# Altium schematic sheet Part23_ETH_LAN.SchDoc
size A4
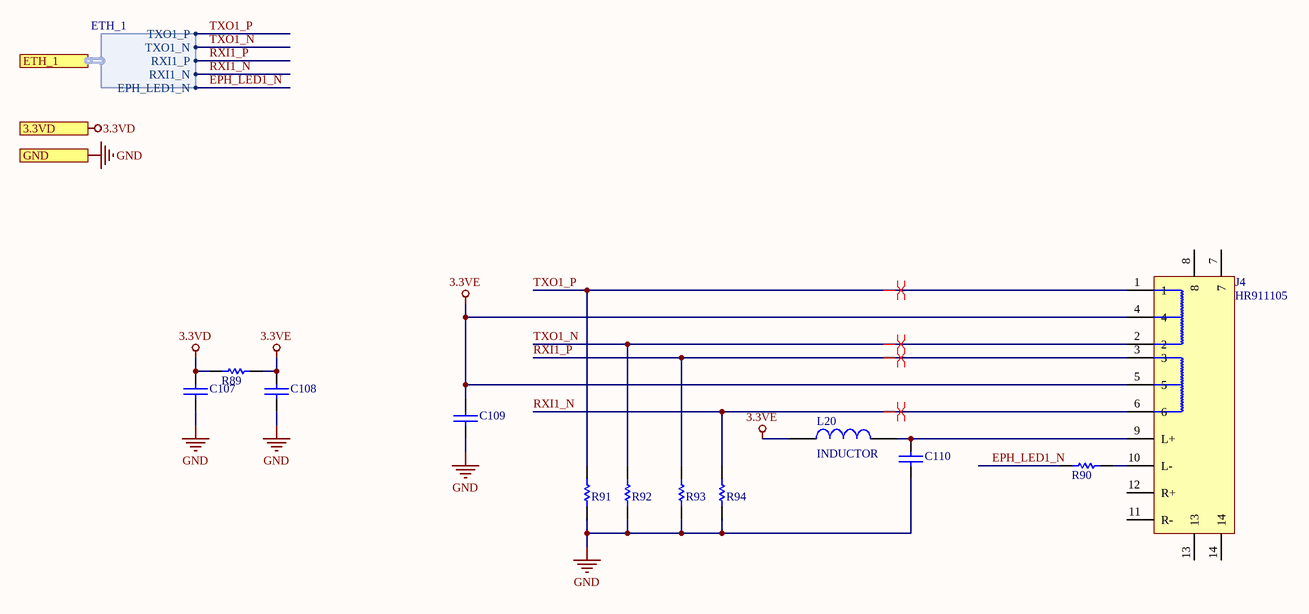
[diagram p0: Part23_ETH_LAN.SchDoc]

## Parts
C107  100nF  [0402C]  (value not drawn)
C108  100nF  [0402C]  (value not drawn)
C109  100nF  [0402C]  (value not drawn)
C110  100nF  [0402C]  (value not drawn)
J4  HR911105  [HR911105A]
L20  INDUCTOR  [0402L]
R89  0R  [0402R]  (value not drawn)
R90  1K  [0402R]  (value not drawn)
R91  49.9R  [0402R]  (value not drawn)
R92  49.9R  [0402R]  (value not drawn)
R93  49.9R  [0402R]  (value not drawn)
R94  49.9R  [0402R]  (value not drawn)

## Ports
3.3VD, ETH_1 (harness ETH_1), GND

## Harnesses
ETH_1: TXO1_P, TXO1_N, RXI1_P, RXI1_N, EPH_LED1_N

## Nets
3.3VD: C107.1 R89.1 ; port 3.3VD
3.3VE: C108.1 C109.1 J4.4 J4.5 L20.1 R89.2
GND: C107.2 C108.2 C109.2 C110.2 R91.1 R92.1 R93.1 R94.1 ; port GND
EPH_LED1_N: R90.2 ; port ETH_1.EPH_LED1_N
RXI1_N: J4.6 R94.2 ; port ETH_1.RXI1_N
RXI1_P: J4.3 R93.2 ; port ETH_1.RXI1_P
TXO1_N: J4.2 R92.2 ; port ETH_1.TXO1_N
TXO1_P: J4.1 R91.2 ; port ETH_1.TXO1_P
NetC110_1: C110.1 J4.9(L+) L20.2
NetJ4_10: J4.10(L-) R90.1

Not connected (* = marked no-connect by the designer): J4 7 8 11(R-) 12(R+) 13 14

## Layout directives
differential pair: RXI1_N, RXI1_P, TXO1_N, TXO1_P

## Library data of the parts
C107-C110 = CAP: 无极性电容
R89-R94 = RES